# EAGLE design portable-atmega328 (EAGLE 7.2.0)
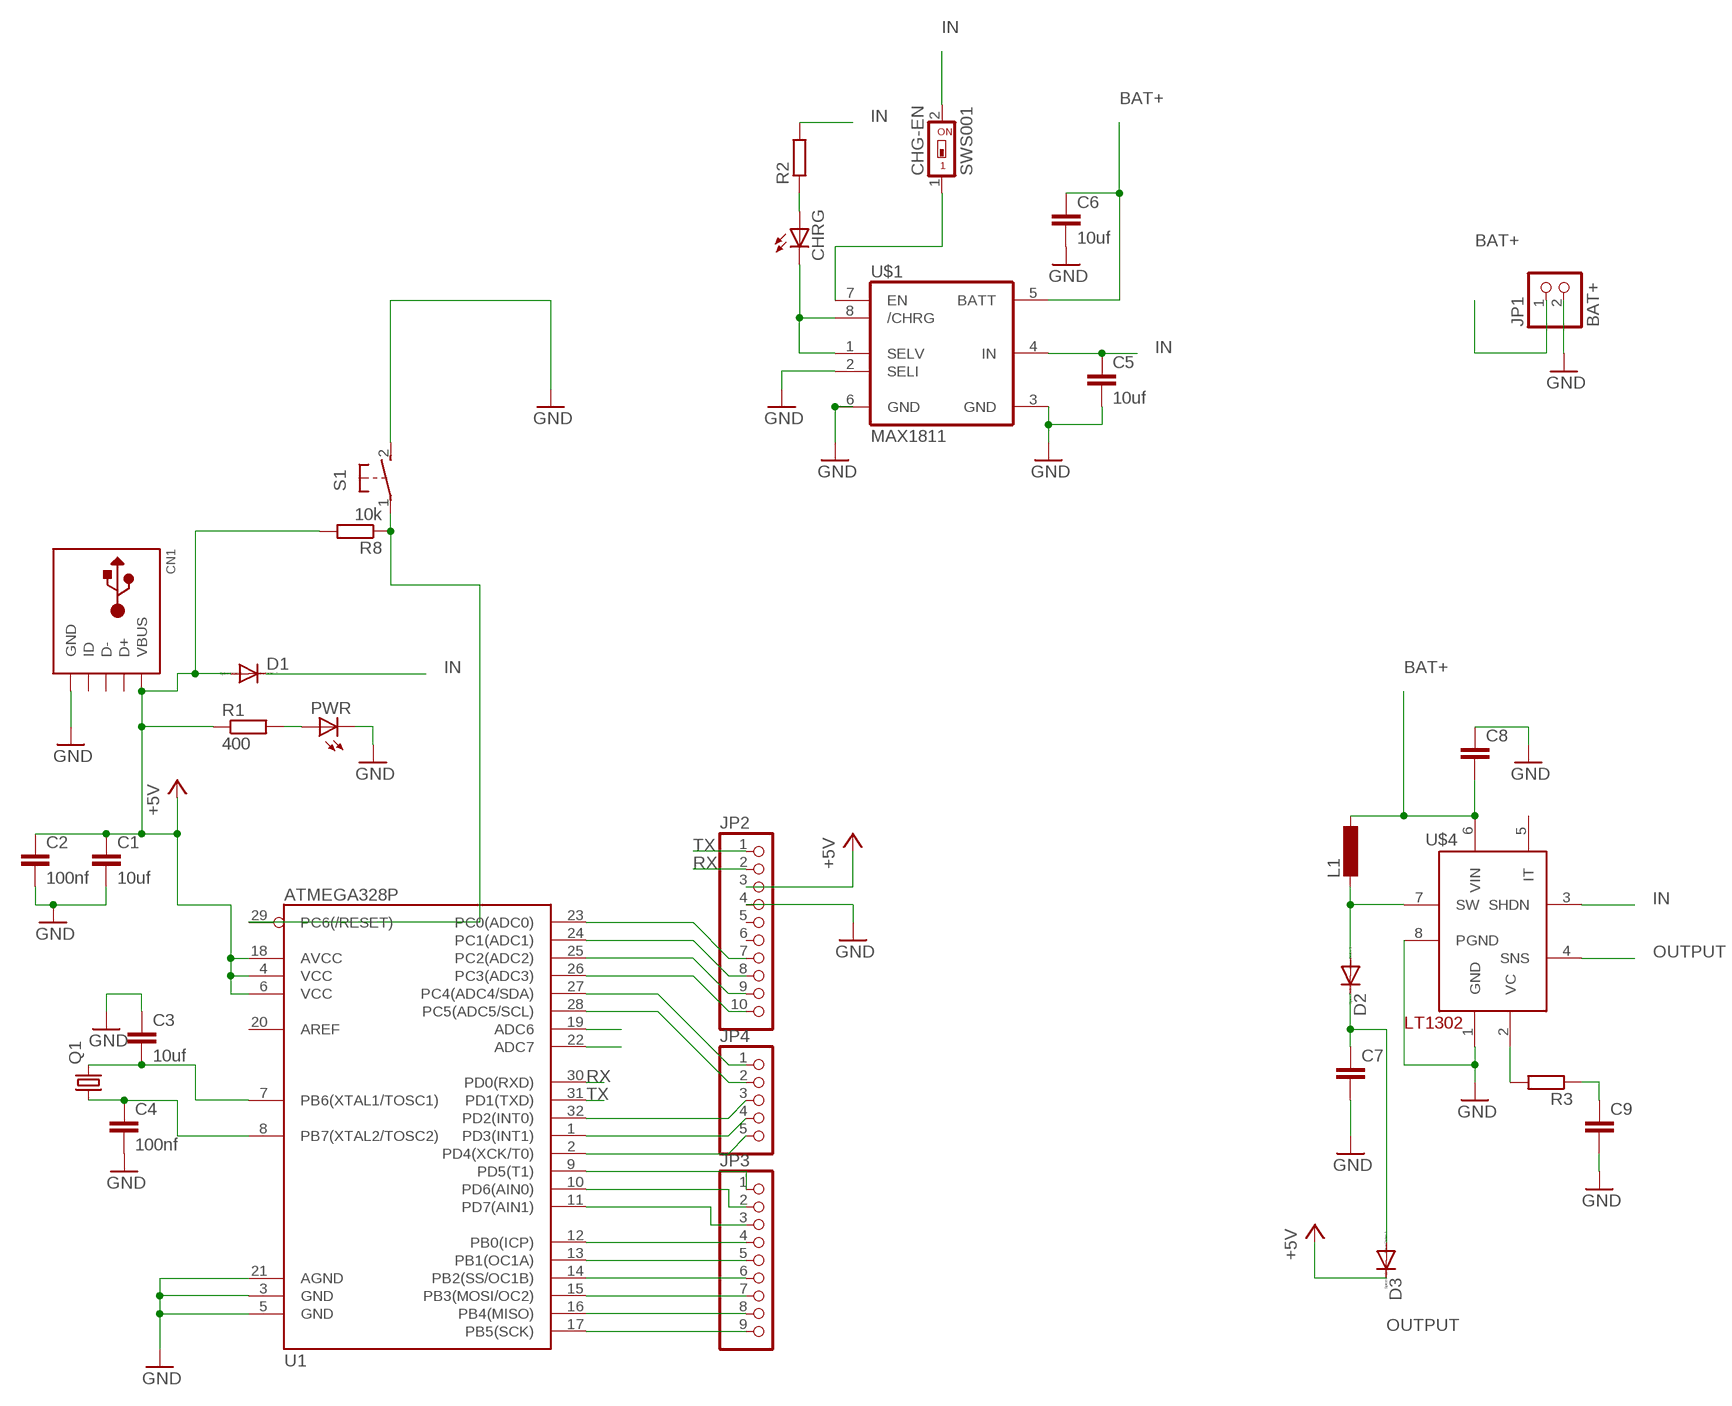
[diagram p0: schematic, sheet 1]

## Parts
C1  10uf  C-EUC1206  [C1206]
C2  100nf  C-EUC1206  [C1206]
C3  10uf  C-EUC1206  [C1206]
C4  100nf  C-EUC1206  [C1206]
C5  10uf  C-EUC1206  [C1206]
C6  10uf  C-EUC1206  [C1206]
C7  C-EUC3225  [C3225]
C8  C-EUC1206  [C1206]
C9  C-EUC1206  [C1206]
CHG-EN  SWS001  [SMS-001]
CHRG  LEDCHIPLED_1206  [CHIPLED_1206]
CN1  USBMINIB  [USB-MINIB]
D1  DIODE-DO214AA  [DO214AA]
D2  DIODE-DO214AA  [DO214AA]
D3  DIODE-DO214AA  [DO214AA]
JP1  BAT+  PINHD-1X2  [1X02]
JP2  PINHD-1X10  [1X10]
JP3  PINHD-1X9  [1X09]
JP4  PINHD-1X5  [1X05]
L1  DO3316P  [DO3316P]
PWR  LEDCHIPLED_1206  [CHIPLED_1206]
Q1  CRYSTALHC49S  [HC49/S]
R1  400  R-EU_R1206  [R1206]
R2  R-EU_R1206  [R1206]
R3  R-EU_R1206  [R1206]
R8  10k  R-EU_R0805  [R0805]
S1  31-XXSKINNY  [B3F-31XX-SKINNIER]
U1  ATMEGA328P  ATMEGA328_SMT  [TQFP32-08]
U$1  MAX1811  [SO08]
U$4  LT1302SO8  [SO08]

## Nets
+5V: C1.1 C2.1 CN1.VBUS D1.A D3.C JP2.3 R1.1 R8.2 U1.4(VCC) U1.6(VCC) U1.18(AVCC)
BAT+: C6.1 C8.2 JP1.1 L1.2 U$1.5(BATT) U$4.6(VIN)
GND: C1.2 C2.2 C3.1 C4.2 C5.2 C6.2 C7.2 C8.1 C9.2 CN1.GND JP1.2 JP2.4 PWR.C S1.2(S) U1.3(GND) U1.5(GND) U1.21(AGND) U$1.2(SELI) U$1.3(GND) U$1.6(GND) U$4.1(GND) U$4.8(PGND)
IN: C5.1 CHG-EN.2 D1.C R2.2 U$1.4(IN) U$4.3(SHDN)
N$1: PWR.A R1.2
N$2: JP3.1 U1.9(PD5(T1))
N$3: C4.1 Q1.1 U1.8(PB7(XTAL2/TOSC2))
N$4: CHRG.C U$1.1(SELV) U$1.8(/CHRG)
N$5: CHRG.A R2.1
N$6: C3.2 Q1.2 U1.7(PB6(XTAL1/TOSC1))
N$7: CHG-EN.1 U$1.7(EN)
N$8: D2.A L1.1 U$4.7(SW)
N$9: JP3.2 U1.10(PD6(AIN0))
N$10: JP3.3 U1.11(PD7(AIN1))
N$11: JP3.4 U1.12(PB0(ICP))
N$12: C9.1 R3.1
N$13: R3.2 U$4.2(VC)
N$14: JP3.5 U1.13(PB1(OC1A))
N$15: JP3.6 U1.14(PB2(SS/OC1B))
N$16: JP3.7 U1.15(PB3(MOSI/OC2))
N$17: JP3.8 U1.16(PB4(MISO))
N$18: JP4.5 U1.2(PD4(XCK/T0))
N$19: JP4.4 U1.1(PD3(INT1))
N$20: JP4.3 U1.32(PD2(INT0))
N$21: JP4.2 U1.28(PC5(ADC5/SCL))
N$22: JP3.9 U1.17(PB5(SCK))
N$23: JP4.1 U1.27(PC4(ADC4/SDA))
N$24: U1.22(ADC7)
N$25: JP2.10 U1.26(PC3(ADC3))
N$26: JP2.9 U1.25(PC2(ADC2))
N$27: JP2.8 U1.24(PC1(ADC1))
N$28: JP2.7 U1.23(PC0(ADC0))
N$29: U1.19(ADC6)
N$32: R8.1 S1.1(P) U1.29(PC6(/RESET))
OUTPUT: C7.1 D2.C D3.A U$4.4(SNS)
RX: JP2.2 U1.30(PD0(RXD))
TX: JP2.1 U1.31(PD1(TXD))
Unconnected: CN1.D+ CN1.D- CN1.ID JP2.5 JP2.6 U1.20(AREF) U$4.5(IT)

## Library data of the parts
C1-C9 = resistor:C-EU: CAPACITOR, European symbol
CHG-EN = smd-special:SWS001: SMD Dip Switch 1 pol.
CHRG PWR = adafruit:LED: LED OSRAM: - CHIPLED LG R971, LG N971, LY N971, LG Q971, LY Q971, LO R971, LY R971 LH N974, LH R974 LS Q976, LO Q976, LY Q976 LO Q996 - Hyper CHIPLED LW Q18S LB Q993, LB Q99A, LB R99A - SideLED LS A670, LO A670, LY A670, LG A670, LP A670 LB A673, LV A673, LT A673, LW A673 LH A674 LY A675 LS A676, LA A676, LO A676, LY A676, LW A676 LS A679, LY A679, LG A679 - Hyper Micro SIDELED® LS Y876, LA Y876, LO Y876, LY Y876 LT Y87S - SmartLED LW L88C, LW L88S LB L89C, LB L89S, LG L890 LS L89K, LO L89K, LY L89K LS L896, LA L896, LO L896, LY L896 - TOPLED LS T670, LO T670, LY T670, LG T670, LP T670 LSG T670, LSP T670, LSY T670, LOP T670, LYG T670 LG T671, LOG T671, LSG T671 LB T673, LV T673, LT T673, LW T673 LH T674 LS T676, LA T676, LO T676, LY T676, LB T676, LH T676, LSB T676, LW T676 LB T67C, LV T67C, LT T67C, LS T67K, LO T67K, LY T67K, LW E67C LS E67B, LA E67B, LO E67B, LY E67B, LB E67C, LV E67C, LT E67C LW T67C LS T679, LY T679, LG T679 LS T770, LO T770, LY T770, LG T770, LP T770 LB T773, LV T773, LT T773, LW T773 LH T774 LS E675, LA E675, LY E675, LS T675 LS T776, LA T776, LO T776, LY T776, LB T776 LHGB T686 LT T68C, LB T68C - Hyper Mini TOPLED® LB M676 - Mini TOPLED Santana® LG M470 LS M47K, LO M47K, LY M47K Source: http://www.osram.convergy.de/
CN1 = adafruit:USB: USB Connectors USBMINIB - Surface Mount Female Mini-B USB Connector 4UConnector: 06564 By microbuilder.eu Thru-hole RA Female Mini-B USB Connector 4UConnector: 18732 By ladyada.net
D1-D3 = diode:DIODE-: DIODE
JP1 = pinhead:PINHD-1X2: PIN HEADER
JP2 = pinhead:PINHD-1X10: PIN HEADER
JP3 = pinhead:PINHD-1X9: PIN HEADER
JP4 = pinhead:PINHD-1X5: PIN HEADER
L1 = inductor-coilcraft:DO3316P: COILCRAFT; OC_FARNELL: unknown; OC_NEWARK: unknown
Q1 = adafruit:CRYSTAL: CRYSTAL; OC_FARNELL: 1667008; OC_NEWARK: unknown
R1-R3 = resistor:R-EU_: RESISTOR, European symbol
R8 = solar3-1:R-EU_: RESISTOR, European symbol
S1 = adafruit:31-XX: OMRON SWITCH Now with beefier pads!
U1 = SparkFun-DigitalIC:ATMEGA328_SMT: 32-Pin Atmega328 part Commonly used on Arduino compatible boards Available in QFP and QFN packages TQFP is IC-09069 QFN is non-stock; PROD_ID: IC-09069
U$1 = max1811-modified:MAX1811
U$4 = adafruit:LT1302

## Board
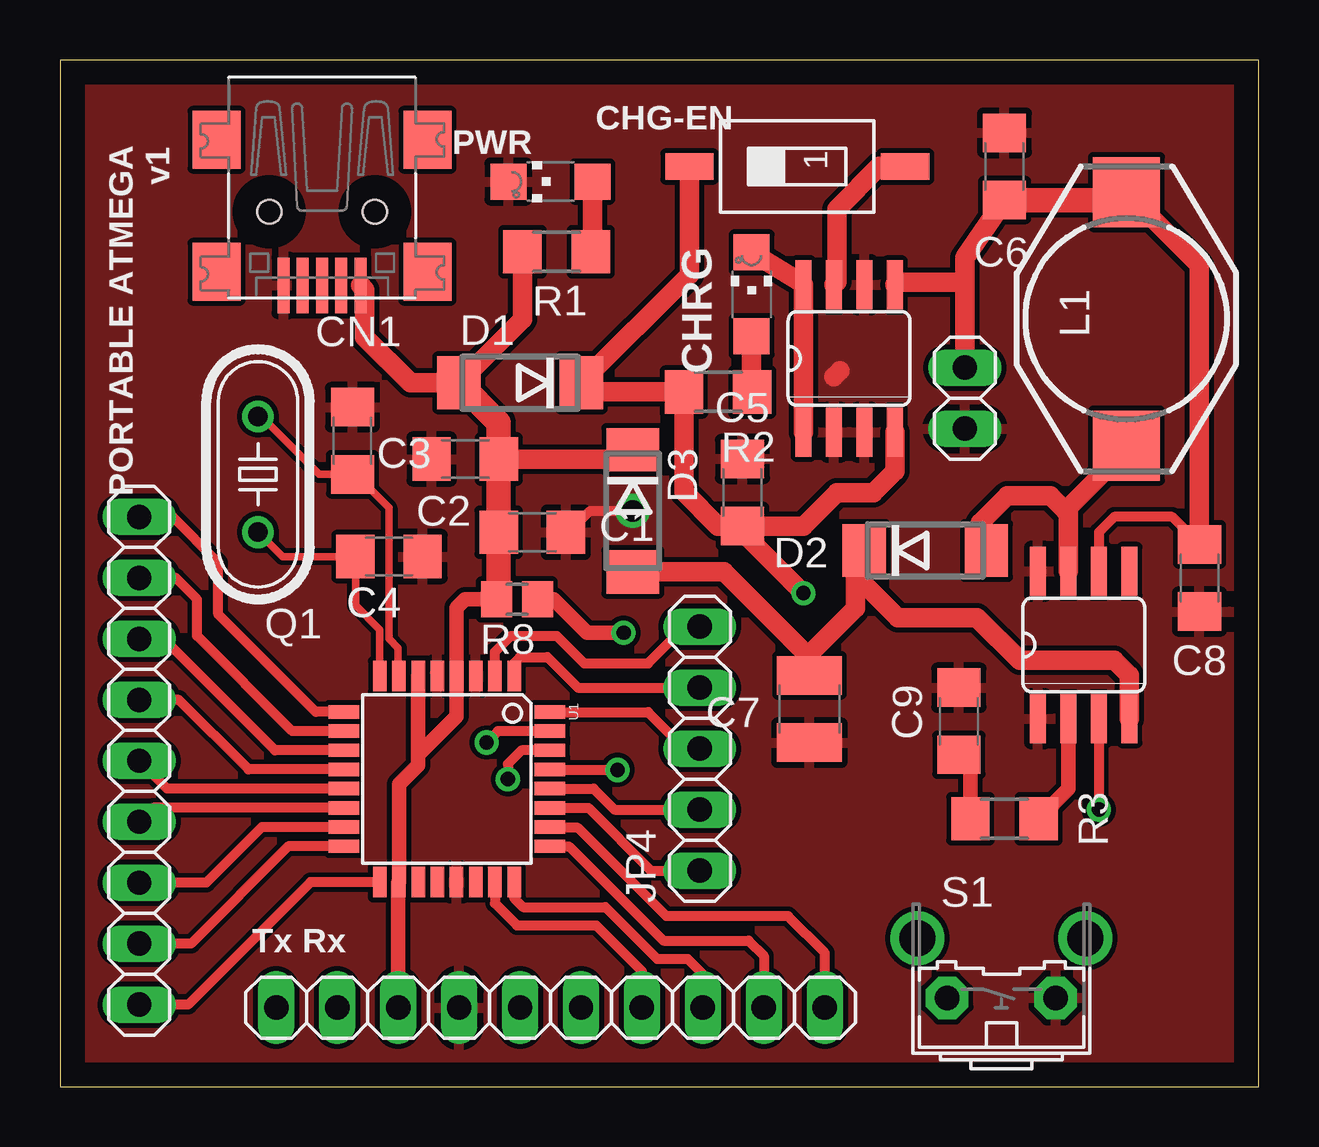
[diagram p1: board, top side]
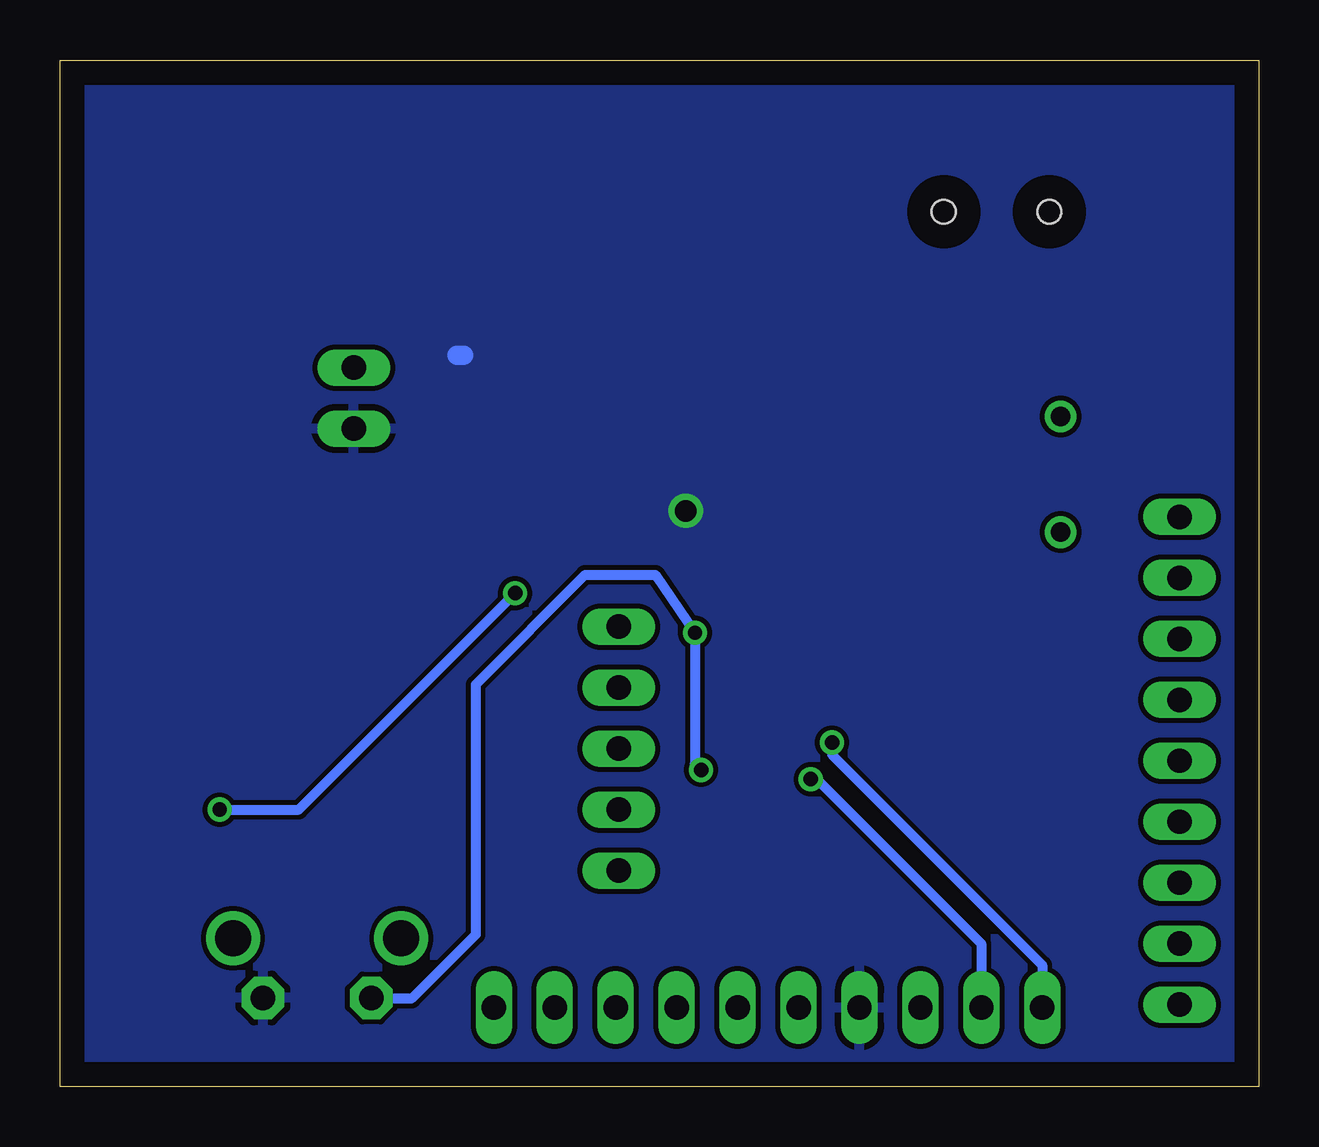
[diagram p2: board, bottom side, seen from below]

Size 49.96 x 42.79 mm. Coordinates in mm from the lower left corner, seen from the top.
Outline: 0,0 49.96,0 49.96,42.79 0,42.79 0,0
Copper layers (1*16): Top 0.035mm / dielectric 1.5mm / Bottom 0.035mm
Design rules "default": minimum track width 10mil, minimum drill 24mil, track to track 8mil, track to pad 8mil, pad to pad 8mil, via to via 8mil, smd to smd 8mil, copper to edge 40mil, drill to drill 8mil, minimum pad ring 10mil, minimum via ring 8mil, stop-mask expansion 4mil, vias tented up to drill 0mil, thermal gap 10mil

### Footprints (pad centres in the part's own frame; a part is rotated, then mirrored left to right if it is on the bottom)
C1206 = smd 1.6 x 1.8: 1 -1.4,0; 2 1.4,0
C3225 = smd 1.6 x 2.7: 1 -1.4,0; 2 1.4,0
SMS-001 = smd 1.092 x 2.007: 1 0,-4.496; 2 0,4.496
CHIPLED_1206 = smd 1.5 x 1.5: A 0,-1.75; C 0,1.75
USB-MINIB = smd 0.5 x 2.308: D+ 0,4.064; D- -0.8,4.064; GND 1.6,4.064; ID 0.8,4.064; VBUS -1.6,4.064 | smd 2 x 2.4: GND1 -4.4,-2; GND2 -4.4,3.5; GND3 4.4,3.5; GND4 4.4,-2 | hole 1: -2.2,1; 2.2,1
DO214AA = smd 1.8 x 2.2: A 2.55,0; C -2.55,0
1X02 = drill 1.016 long: 1 -1.27,0; 2 1.27,0
1X10 = drill 1.016 long: 1 -11.43,0; 2 -8.89,0; 3 -6.35,0; 4 -3.81,0; 5 -1.27,0; 6 1.27,0; 7 3.81,0; 8 6.35,0; 9 8.89,0; 10 11.43,0
1X09 = drill 1.016 long: 1 -10.16,0; 2 -7.62,0; 3 -5.08,0; 4 -2.54,0; 5 0,0; 6 2.54,0; 7 5.08,0; 8 7.62,0; 9 10.16,0
1X05 = drill 1.016 long: 1 -5.08,0; 2 -2.54,0; 3 0,0; 4 2.54,0; 5 5.08,0
DO3316P = smd 2.92 x 2.79: 1 -5.28,0; 2 5.28,0
HC49/S = drill 0.813: 1 -2.413,0; 2 2.413,0
R1206 = smd 1.6 x 1.803: 1 -1.422,0; 2 1.422,0
R0805 = smd 1.3 x 1.5: 1 -0.85,0; 2 0.85,0
B3F-31XX-SKINNIER = drill 1.016 pad 1.778 octagon: 1 -2.261,-1.245; 2 2.261,-1.245 | drill 1.499 pad 2.032: 3 -3.505,1.245; 4 3.505,1.245
TQFP32-08 = smd 1.27 x 0.559: 1 -4.293,2.8; 2 -4.293,2; 3 -4.293,1.2; 4 -4.293,0.4; 5 -4.293,-0.4; 6 -4.293,-1.2; 7 -4.293,-2; 8 -4.293,-2.8; 17 4.293,-2.8; 18 4.293,-2; 19 4.293,-1.2; 20 4.293,-0.4; 21 4.293,0.4; 22 4.293,1.2; 23 4.293,2; 24 4.293,2.8 | smd 0.559 x 1.27: 9 -2.8,-4.293; 10 -2,-4.293; 11 -1.2,-4.293; 12 -0.4,-4.293; 13 0.4,-4.293; 14 1.2,-4.293; 15 2,-4.293; 16 2.8,-4.293; 25 2.8,4.293; 26 2,4.293; 27 1.2,4.293; 28 0.4,4.293; 29 -0.4,4.293; 30 -1.2,4.293; 31 -2,4.293; 32 -2.8,4.293
SO08 = smd 0.66 x 2.032: 1 -1.905,-3.073; 2 -0.635,-3.073; 3 0.635,-3.073; 4 1.905,-3.073; 5 1.905,3.073; 6 0.635,3.073; 7 -0.635,3.073; 8 -1.905,3.073

### Placement (x,y rotation side)
C1  19.69,23.11 0 top
C2  16.89,26.16 180 top
C3  12.19,26.92 270 top
C4  13.72,22.1 0 top
C5  28.45,24.77 90 top
C6  39.37,38.35 90 top
C7  31.24,15.75 270 top
C8  47.5,21.21 90 top
C9  37.46,15.24 90 top
CHG-EN  30.73,38.35 90 top
CHRG  28.83,33.02 0 top
CN1  10.92,37.47 180 top
D1  19.18,29.34 180 top
D2  36.07,22.35 0 top
D3  23.88,24 270 top
JP1  37.72,28.7 270 top
JP2  20.45,3.3 0 top
JP3  3.3,13.59 270 top
JP4  26.67,14.1 90 top
L1  44.45,32 90 top
PWR  20.45,37.72 90 top
Q1  8.25,25.53 90 top
R1  20.7,34.8 0 top
R2  27.43,28.96 180 top
R3  39.37,11.18 0 top
R8  19.05,20.32 180 top
S1  39.24,4.95 0 top
U1  16.13,12.83 270 top
U$1  32.89,30.35 0 top
U$4  42.67,18.41 0 top

### Tracks (layer width: path | path; a pad name or v marks a point on that pad's centre or on a via)
+5V
  Top 0.61: R8.2 16.89,20.32 16.53,19.96 U1.4 16.53,15.44 14.93,13.84 | U1.6 14.93,13.84 | 14.93,13.84 14.93,13.4 14.13,12.61 U1.18 14.1,8.5 JP2.3
  Top 0.813: R1.1 19.28,31.99 D1.A 14.61,29.34 12.7,31.24 12.7,33.22 CN1.VBUS | C2.1 23.49,26.16 D3.C
  Top 1.016: R8.2 18.29,20.41 C1.1 C2.1 18.29,27.68 D1.A
BAT+
  Top 0.406: C8.2 46.36,23.75 43.94,23.75 43.31,23.11 U$4.6
  Top 0.813: L1.2 47.5,34.24 C8.2 | C6.1 37.72,34.54 37.72,33.53 | 37.72,33.53 JP1.1 | U$1.5 34.9,33.53 37.72,33.53
  Top 1.016: C6.1 44.12,36.95 L1.2
GND  (via drill 0.9 pad 1.42)
  Top 0.406: C1.2 21.21,23.11 22.1,24 v23.88,24 24,24
  Top 0.813: 32.26,29.59 32.51,29.84
  Bottom 0.813: 33.4,30.48 33.15,30.48
  pour Bottom: -3.17,44.45 53.21,44.45 54.1,-3.81 -2.29,-3.68
  pour Top: 56.01,-6.48 -4.32,-5.97 -4.7,46.48 55.63,45.97
IN  (via drill 0.6)
  Top 0.406: U$4.3 v43.31,11.56
  Top 0.813: CHG-EN.2 26.24,33.85 D1.C 21.69,28.96 R2.2 26.01,24.79 27.43,23.37 C5.1 | C5.1 28.45,23.11 v30.99,20.57 | U$1.4 34.8,25.65 33.91,24.77 32.38,24.77 30.99,23.37 C5.1
  Bottom 0.406: v43.31,11.56 40,11.56 v30.99,20.57
N$1
  Top 0.813: PWR.A 22.2,34.87 R1.2
N$2
  Top 0.406: U1.9 10.66,15.63 6.6,19.68 6.6,21.84 4.7,23.75 JP3.1
N$3
  Top 0.305: U1.8 13.33,19.06 12.32,20.07 C4.1 9.27,22.1 Q1.1
N$4
  Top 0.813: CHRG.C 30.91,33.5 U$1.8 U$1.1
N$5
  Top 0.813: CHRG.A 28.83,28.73 R2.1
N$6
  Top 0.305: Q1.2 8.38,27.94 10.79,25.53 C3.2 12.32,25.52 13.72,24.13 13.72,18.67 14.1,18.29 14.1,17.15 U1.7
N$7
  Top 0.813: CHG-EN.1 34.16,38.35 32.38,36.58 32.38,33.55 U$1.7
N$8
  Top 0.813: D2.A 38.36,23.5 39.5,24.64 41.27,24.64 41.91,24 | 41.91,24 42.04,23.88 U$4.7 | L1.1 44.45,26.54 41.91,24
N$9
  Top 0.406: U1.10 9.68,14.83 5.71,18.8 5.71,20.32 4.83,21.21 JP3.2
N$10
  Top 0.406: U1.11 8.96,14.03 4.32,18.67 JP3.3
N$11
  Top 0.406: U1.12 7.86,13.23 4.95,16.13 JP3.4
N$12
  Top 0.61: R3.1 37.95,13.36 C9.1
N$13
  Top 0.61: U$4.2 42.04,12.42 R3.2
N$14
  Top 0.406: U1.13 4.46,12.43 JP3.5
N$15
  Top 0.406: U1.14 3.88,11.63 JP3.6
N$16
  Top 0.406: U1.15 8.41,10.83 6.1,8.51 JP3.7
N$17
  Top 0.406: U1.16 9.52,10.03 5.46,5.97 JP3.8
N$18
  Top 0.406: U1.2 18.13,18.13 18.8,18.8 20.7,18.8 21.84,17.65 24.51,17.65 26.04,19.18 JP4.5
N$19
  Top 0.406: U1.1 18.93,17.66 19.18,17.91 20.32,17.91 21.59,16.64 JP4.4
N$20
  Top 0.406: U1.32 24.51,15.62 26.04,14.1 JP4.3 26.8,14.1
N$21
  Top 0.406: U1.28 22.24,12.43 23.11,11.56 JP4.2
N$22
  Top 0.406: U1.17 10.44,8.53 5.33,3.43 JP3.9
N$23
  Top 0.406: U1.27 22.03,11.63 24.64,9.02 JP4.1
N$25
  Top 0.406: JP2.10 31.88,5.59 30.35,7.11 25.27,7.11 21.59,10.79 20.45,10.79 U1.26
N$26
  Top 0.406: U1.25 21.21,10.03 25.15,6.1 28.7,6.1 29.34,5.46 JP2.9
N$27
  Top 0.406: U1.24 18.93,7.87 19.3,7.49 22.73,7.49 24.89,5.33 26.16,5.33 26.8,4.7 JP2.8
N$28
  Top 0.406: U1.23 18.13,7.65 19.05,6.73 22.35,6.73 24.26,4.83 JP2.7
N$32  (via drill 0.6)
  Top 0.406: v23.24,13.21 20.45,13.21 U1.29
  Top 0.61: R8.1 20.57,20.32 21.97,18.92 v23.5,18.92
  Bottom 0.406: v23.24,13.21 23.5,13.46 v23.5,18.92 25.15,21.34 28.07,21.34 32.64,16.76 32.64,6.35 35.31,3.68 36.96,3.68 S1.1
OUTPUT
  Top 0.813: U$4.4 44.58,17.14 43.94,17.78 40,17.78 38.23,19.56 34.92,19.56 33.26,21.22 D2.C 33.15,21.98 33.15,19.94 31.24,18.03 | C7.1 31.24,18.03 | 31.24,18.03 31.12,18.03 27.69,21.46 23.89,21.46 D3.A
RX  (via drill 0.6)
  Top 0.406: U1.30 19.23,14.03 18.67,13.46 v18.67,12.83
  Bottom 0.406: v18.67,12.83 18.42,12.83 11.56,5.97 JP2.2
TX  (via drill 0.6)
  Top 0.406: U1.31 18.26,14.83 v17.78,14.35
  Bottom 0.406: v17.78,14.35 17.78,13.84 9.02,5.08 JP2.1

### Text on the board
tNames: PORTABLE ATMEGA | v1 | Tx Rx